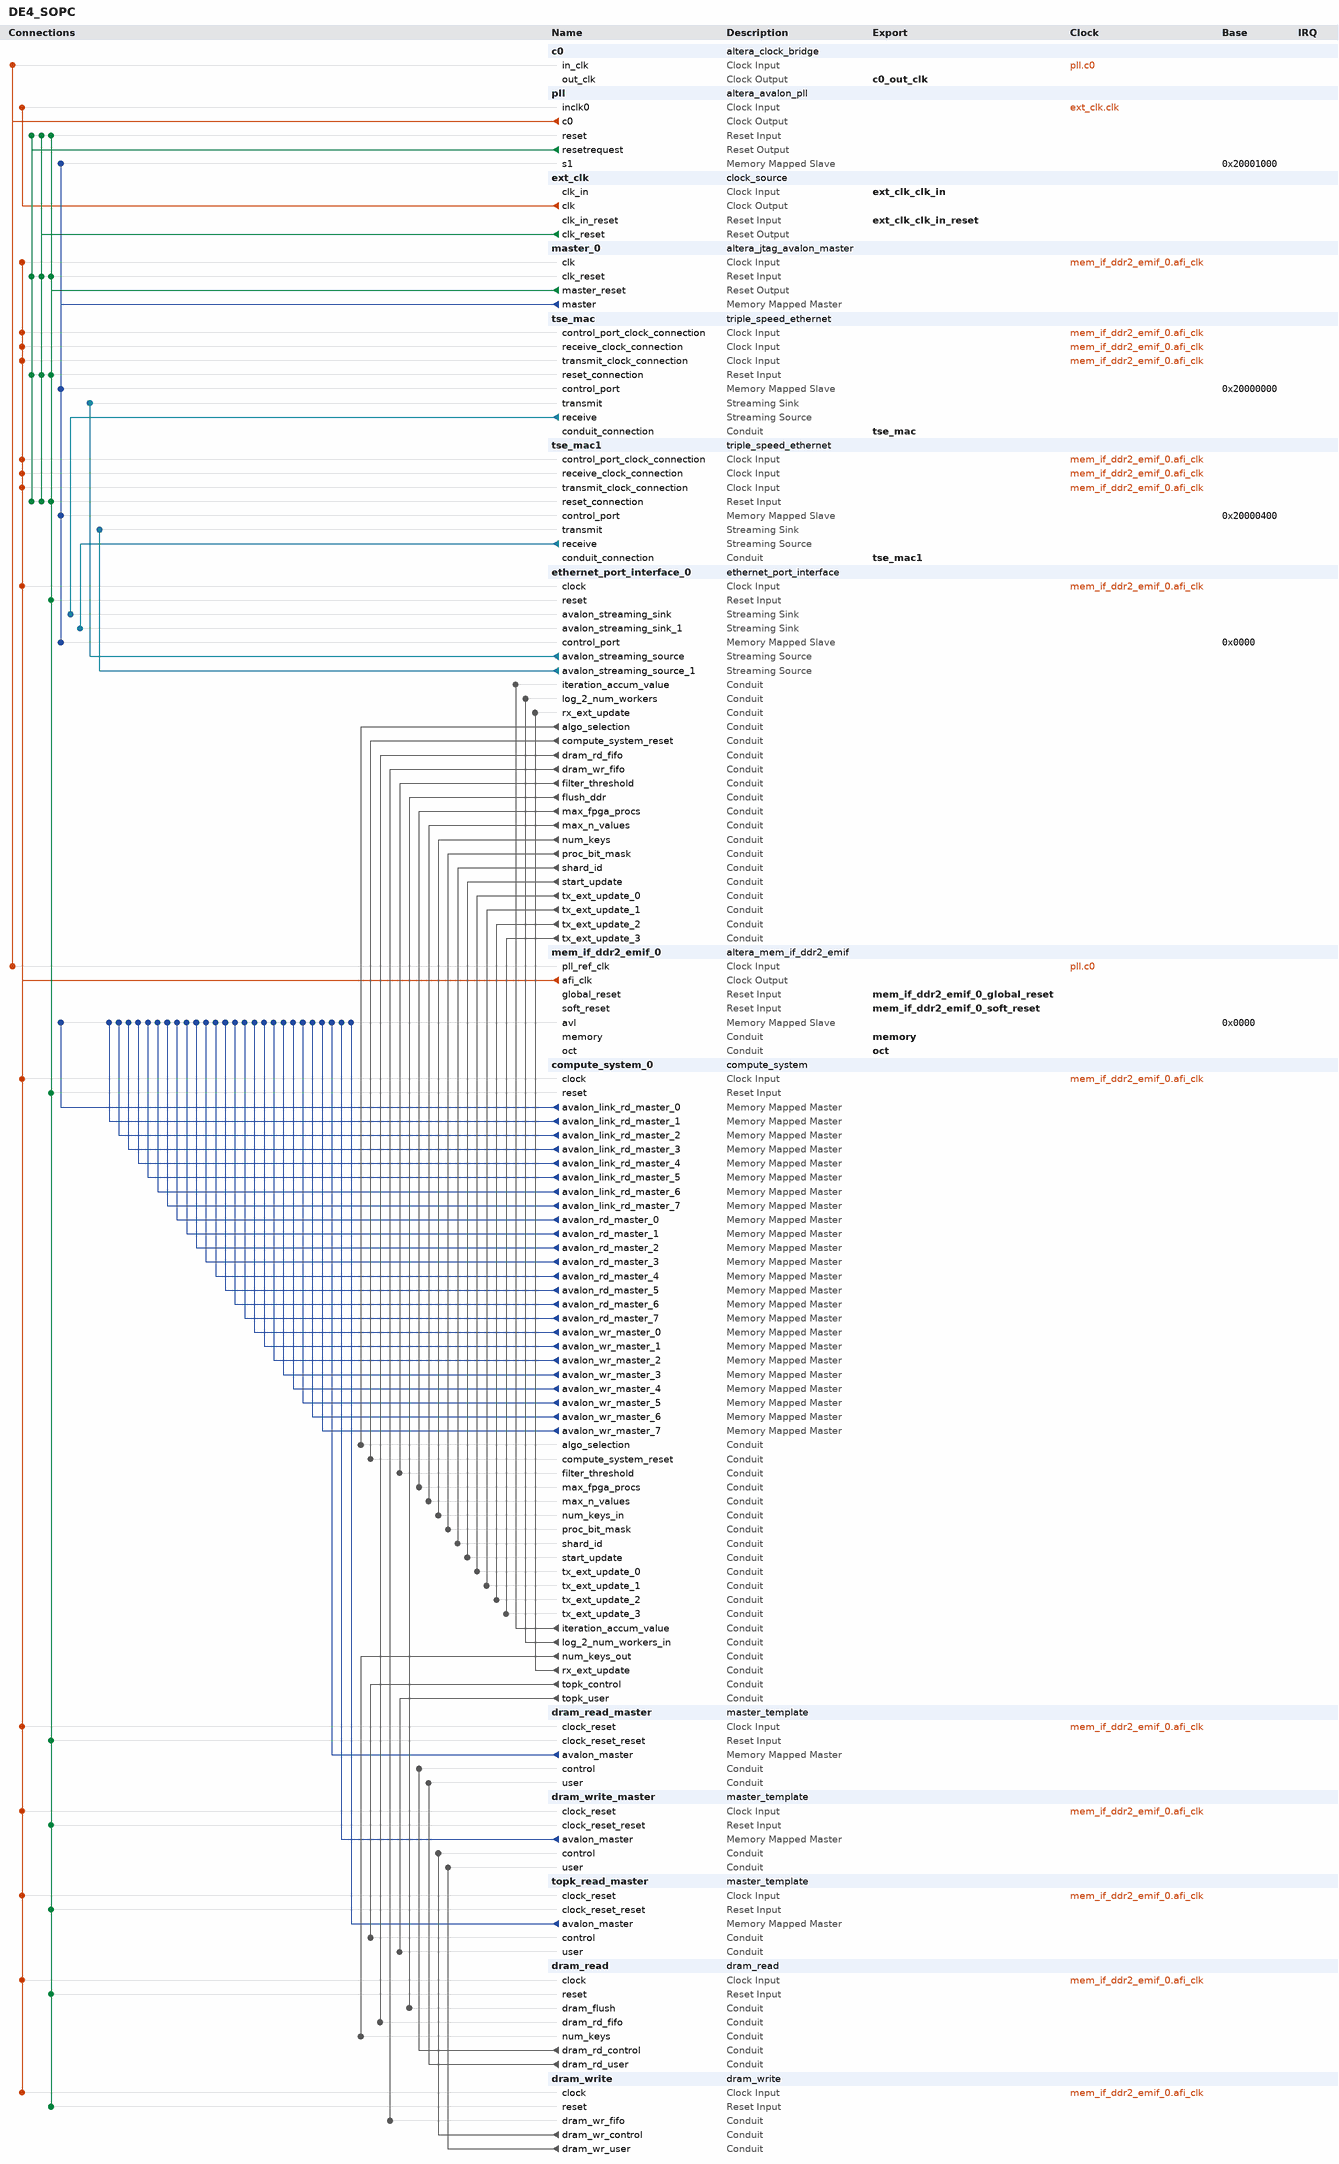
[diagram p0: system contents]
# Platform Designer (Qsys) system DE4_SOPC, Stratix IV EP4SGX230KF40C2
# Parameters at their usual value, and those the tool derives, are not listed.
package require -exact qsys 12.0
create_system DE4_SOPC
set_project_property DEVICE_FAMILY {Stratix IV}
set_project_property DEVICE EP4SGX230KF40C2

add_instance c0 altera_clock_bridge 12.0
set_instance_parameter_value c0 DERIVED_CLOCK_RATE 50000000
set_instance_parameter_value c0 EXPLICIT_CLOCK_RATE 0

add_instance pll altera_avalon_pll 12.0
set_instance_parameter_value pll c0 {tap c0 mult 1 div 1 phase 0 enabled true inputfreq 50000000 outputfreq 50000000}
set_instance_parameter_value pll c1 {tap c1 mult 1 div 5 phase 0 enabled true inputfreq 50000000 outputfreq 10000000}
set_instance_parameter_value pll c2 {tap c2 mult 1 div 1 phase 0 enabled false inputfreq 0 outputfreq 0}
set_instance_parameter_value pll c3 {tap c3 mult 1 div 1 phase 0 enabled false inputfreq 0 outputfreq 0}
set_instance_parameter_value pll c4 {tap c4 mult 1 div 1 phase 0 enabled false inputfreq 0 outputfreq 0}
set_instance_parameter_value pll c5 {tap c5 mult 1 div 1 phase 0 enabled false inputfreq 0 outputfreq 0}
set_instance_parameter_value pll c6 {tap c6 mult 1 div 1 phase 0 enabled false inputfreq 0 outputfreq 0}
set_instance_parameter_value pll c7 {tap c7 mult 1 div 1 phase 0 enabled false inputfreq 0 outputfreq 0}
set_instance_parameter_value pll c8 {tap c8 mult 1 div 1 phase 0 enabled false inputfreq 0 outputfreq 0}
set_instance_parameter_value pll c9 {tap c9 mult 1 div 1 phase 0 enabled false inputfreq 0 outputfreq 0}
set_instance_parameter_value pll e0 {tap e0 mult 1 div 1 phase 0 enabled false inputfreq 0 outputfreq 0}
set_instance_parameter_value pll e1 {tap e1 mult 1 div 1 phase 0 enabled false inputfreq 0 outputfreq 0}
set_instance_parameter_value pll e2 {tap e2 mult 1 div 1 phase 0 enabled false inputfreq 0 outputfreq 0}
set_instance_parameter_value pll e3 {tap e3 mult 1 div 1 phase 0 enabled false inputfreq 0 outputfreq 0}
set_instance_parameter_value pll inputClockRate 50000000
set_instance_parameter_value pll lockedOutputPortOption Export
set_instance_parameter_value pll pfdenaInputPortOption Register
set_instance_parameter_value pll resetInputPortOption Register

add_instance ext_clk clock_source 12.0
set_instance_parameter_value ext_clk clockFrequency 50000000

add_instance master_0 altera_jtag_avalon_master 12.0

add_instance tse_mac triple_speed_ethernet 12.0
set_instance_parameter_value tse_mac atlanticSinkClockRate 0
set_instance_parameter_value tse_mac atlanticSinkClockSource unassigned
set_instance_parameter_value tse_mac atlanticSourceClockRate 0
set_instance_parameter_value tse_mac atlanticSourceClockSource unassigned
set_instance_parameter_value tse_mac avalonSlaveClockRate 0
set_instance_parameter_value tse_mac avalonSlaveClockSource unassigned
set_instance_parameter_value tse_mac avalonStNeighbours {unassigned=unassigned}
set_instance_parameter_value tse_mac channel_count 1
set_instance_parameter_value tse_mac core_variation MAC_PCS
set_instance_parameter_value tse_mac core_version 3072
set_instance_parameter_value tse_mac crc32check16bit 0
set_instance_parameter_value tse_mac crc32dwidth 8
set_instance_parameter_value tse_mac crc32gendelay 6
set_instance_parameter_value tse_mac crc32s1l2_extern false
set_instance_parameter_value tse_mac cust_version 0
set_instance_parameter_value tse_mac dataBitsPerSymbol 8
set_instance_parameter_value tse_mac dev_version 3072
set_instance_parameter_value tse_mac eg_addr 11
set_instance_parameter_value tse_mac ena_hash true
set_instance_parameter_value tse_mac enable_alt_reconfig false
set_instance_parameter_value tse_mac enable_clk_sharing false
set_instance_parameter_value tse_mac enable_ena 8
set_instance_parameter_value tse_mac enable_fifoless false
set_instance_parameter_value tse_mac enable_gmii_loopback false
set_instance_parameter_value tse_mac enable_hd_logic true
set_instance_parameter_value tse_mac enable_mac_flow_ctrl true
set_instance_parameter_value tse_mac enable_mac_txaddr_set true
set_instance_parameter_value tse_mac enable_mac_vlan true
set_instance_parameter_value tse_mac enable_maclite false
set_instance_parameter_value tse_mac enable_magic_detect true
set_instance_parameter_value tse_mac enable_multi_channel false
set_instance_parameter_value tse_mac enable_pkt_class true
set_instance_parameter_value tse_mac enable_pma false
set_instance_parameter_value tse_mac enable_ptp_1step false
set_instance_parameter_value tse_mac enable_reg_sharing false
set_instance_parameter_value tse_mac enable_sgmii true
set_instance_parameter_value tse_mac enable_shift16 false
set_instance_parameter_value tse_mac enable_sup_addr true
set_instance_parameter_value tse_mac enable_timestamping false
set_instance_parameter_value tse_mac enable_use_internal_fifo true
set_instance_parameter_value tse_mac export_calblkclk false
set_instance_parameter_value tse_mac export_pwrdn false
set_instance_parameter_value tse_mac ext_stat_cnt_ena false
set_instance_parameter_value tse_mac gigeAdvanceMode true
set_instance_parameter_value tse_mac ifGMII MII_GMII
set_instance_parameter_value tse_mac ifPCSuseEmbeddedSerdes true
set_instance_parameter_value tse_mac ing_addr 11
set_instance_parameter_value tse_mac insert_ta true
set_instance_parameter_value tse_mac maclite_gige false
set_instance_parameter_value tse_mac max_channels 1
set_instance_parameter_value tse_mac mdio_clk_div 50
set_instance_parameter_value tse_mac phy_identifier 0
set_instance_parameter_value tse_mac ramType AUTO
set_instance_parameter_value tse_mac reset_level 1
set_instance_parameter_value tse_mac starting_channel_number 0
set_instance_parameter_value tse_mac stat_cnt_ena true
set_instance_parameter_value tse_mac timingAdapterName timingAdapter
set_instance_parameter_value tse_mac toolContext SOPC_BUILDER
set_instance_parameter_value tse_mac transceiver_type LVDS_IO
set_instance_parameter_value tse_mac tstamp_fp_width 4
set_instance_parameter_value tse_mac uiHostClockFrequency 0
set_instance_parameter_value tse_mac uiMDIOFreq {0.0 MHz}
set_instance_parameter_value tse_mac useLvds true
set_instance_parameter_value tse_mac useMAC true
set_instance_parameter_value tse_mac useMDIO true
set_instance_parameter_value tse_mac usePCS true
set_instance_parameter_value tse_mac use_sync_reset true

add_instance tse_mac1 triple_speed_ethernet 12.0
set_instance_parameter_value tse_mac1 atlanticSinkClockRate 0
set_instance_parameter_value tse_mac1 atlanticSinkClockSource unassigned
set_instance_parameter_value tse_mac1 atlanticSourceClockRate 0
set_instance_parameter_value tse_mac1 atlanticSourceClockSource unassigned
set_instance_parameter_value tse_mac1 avalonSlaveClockRate 0
set_instance_parameter_value tse_mac1 avalonSlaveClockSource unassigned
set_instance_parameter_value tse_mac1 avalonStNeighbours {unassigned=unassigned}
set_instance_parameter_value tse_mac1 channel_count 1
set_instance_parameter_value tse_mac1 core_variation MAC_PCS
set_instance_parameter_value tse_mac1 core_version 3072
set_instance_parameter_value tse_mac1 crc32check16bit 0
set_instance_parameter_value tse_mac1 crc32dwidth 8
set_instance_parameter_value tse_mac1 crc32gendelay 6
set_instance_parameter_value tse_mac1 crc32s1l2_extern false
set_instance_parameter_value tse_mac1 cust_version 0
set_instance_parameter_value tse_mac1 dataBitsPerSymbol 8
set_instance_parameter_value tse_mac1 dev_version 3072
set_instance_parameter_value tse_mac1 eg_addr 11
set_instance_parameter_value tse_mac1 ena_hash true
set_instance_parameter_value tse_mac1 enable_alt_reconfig false
set_instance_parameter_value tse_mac1 enable_clk_sharing false
set_instance_parameter_value tse_mac1 enable_ena 8
set_instance_parameter_value tse_mac1 enable_fifoless false
set_instance_parameter_value tse_mac1 enable_gmii_loopback false
set_instance_parameter_value tse_mac1 enable_hd_logic true
set_instance_parameter_value tse_mac1 enable_mac_flow_ctrl true
set_instance_parameter_value tse_mac1 enable_mac_txaddr_set true
set_instance_parameter_value tse_mac1 enable_mac_vlan true
set_instance_parameter_value tse_mac1 enable_maclite false
set_instance_parameter_value tse_mac1 enable_magic_detect true
set_instance_parameter_value tse_mac1 enable_multi_channel false
set_instance_parameter_value tse_mac1 enable_pkt_class true
set_instance_parameter_value tse_mac1 enable_pma false
set_instance_parameter_value tse_mac1 enable_ptp_1step false
set_instance_parameter_value tse_mac1 enable_reg_sharing false
set_instance_parameter_value tse_mac1 enable_sgmii true
set_instance_parameter_value tse_mac1 enable_shift16 false
set_instance_parameter_value tse_mac1 enable_sup_addr true
set_instance_parameter_value tse_mac1 enable_timestamping false
set_instance_parameter_value tse_mac1 enable_use_internal_fifo true
set_instance_parameter_value tse_mac1 export_calblkclk false
set_instance_parameter_value tse_mac1 export_pwrdn false
set_instance_parameter_value tse_mac1 ext_stat_cnt_ena false
set_instance_parameter_value tse_mac1 gigeAdvanceMode true
set_instance_parameter_value tse_mac1 ifGMII MII_GMII
set_instance_parameter_value tse_mac1 ifPCSuseEmbeddedSerdes true
set_instance_parameter_value tse_mac1 ing_addr 11
set_instance_parameter_value tse_mac1 insert_ta true
set_instance_parameter_value tse_mac1 maclite_gige false
set_instance_parameter_value tse_mac1 max_channels 1
set_instance_parameter_value tse_mac1 mdio_clk_div 50
set_instance_parameter_value tse_mac1 phy_identifier 0
set_instance_parameter_value tse_mac1 ramType AUTO
set_instance_parameter_value tse_mac1 reset_level 1
set_instance_parameter_value tse_mac1 starting_channel_number 0
set_instance_parameter_value tse_mac1 stat_cnt_ena true
set_instance_parameter_value tse_mac1 timingAdapterName timingAdapter
set_instance_parameter_value tse_mac1 toolContext SOPC_BUILDER
set_instance_parameter_value tse_mac1 transceiver_type LVDS_IO
set_instance_parameter_value tse_mac1 tstamp_fp_width 4
set_instance_parameter_value tse_mac1 uiHostClockFrequency 0
set_instance_parameter_value tse_mac1 uiMDIOFreq {0.0 MHz}
set_instance_parameter_value tse_mac1 useLvds true
set_instance_parameter_value tse_mac1 useMAC true
set_instance_parameter_value tse_mac1 useMDIO true
set_instance_parameter_value tse_mac1 usePCS true
set_instance_parameter_value tse_mac1 use_sync_reset true

add_instance ethernet_port_interface_0 ethernet_port_interface 1.0
set_instance_parameter_value ethernet_port_interface_0 WORKER_ADDR_WIDTH 2
set_instance_parameter_value ethernet_port_interface_0 TOTAL_DATA 8

add_instance mem_if_ddr2_emif_0 altera_mem_if_ddr2_emif 12.0
set_instance_parameter_value mem_if_ddr2_emif_0 MEM_CLK_FREQ 250.0
set_instance_parameter_value mem_if_ddr2_emif_0 MEM_VENDOR Hynix
set_instance_parameter_value mem_if_ddr2_emif_0 MEM_ROW_ADDR_WIDTH 14
set_instance_parameter_value mem_if_ddr2_emif_0 MEM_COL_ADDR_WIDTH 10
set_instance_parameter_value mem_if_ddr2_emif_0 MEM_DQ_WIDTH 64
set_instance_parameter_value mem_if_ddr2_emif_0 MEM_BANKADDR_WIDTH 3
set_instance_parameter_value mem_if_ddr2_emif_0 MEM_NUMBER_OF_RANKS_PER_DIMM 1
set_instance_parameter_value mem_if_ddr2_emif_0 MEM_TCL 4
set_instance_parameter_value mem_if_ddr2_emif_0 TIMING_TIS 250
set_instance_parameter_value mem_if_ddr2_emif_0 TIMING_TIH 375
set_instance_parameter_value mem_if_ddr2_emif_0 TIMING_TDS 100
set_instance_parameter_value mem_if_ddr2_emif_0 TIMING_TDH 225
set_instance_parameter_value mem_if_ddr2_emif_0 TIMING_TDQSQ 200
set_instance_parameter_value mem_if_ddr2_emif_0 TIMING_TQHS 400
set_instance_parameter_value mem_if_ddr2_emif_0 TIMING_TDQSCK 450
set_instance_parameter_value mem_if_ddr2_emif_0 MEM_TMRD_CK 2
set_instance_parameter_value mem_if_ddr2_emif_0 MEM_TRAS_NS 40.0
set_instance_parameter_value mem_if_ddr2_emif_0 MEM_TWTR 2
set_instance_parameter_value mem_if_ddr2_emif_0 POWER_OF_TWO_BUS false
set_instance_parameter_value mem_if_ddr2_emif_0 AVL_MAX_SIZE 4
set_instance_parameter_value mem_if_ddr2_emif_0 CTL_CSR_ENABLED true
set_instance_parameter_value mem_if_ddr2_emif_0 REF_CLK_FREQ 50.0
set_instance_parameter_value mem_if_ddr2_emif_0 DEFAULT_FAST_SIM_MODEL true
set_instance_parameter_value mem_if_ddr2_emif_0 PLL_SHARING_MODE Master
set_instance_parameter_value mem_if_ddr2_emif_0 CALIBRATION_MODE Skip
set_instance_parameter_value mem_if_ddr2_emif_0 USER_DEBUG_LEVEL 1
set_instance_parameter_value mem_if_ddr2_emif_0 DLL_SHARING_MODE Master

add_instance compute_system_0 compute_system 1.0
set_instance_parameter_value compute_system_0 DATA_WIDTH 32
set_instance_parameter_value compute_system_0 MAX_NUM_PROCS 4
set_instance_parameter_value compute_system_0 WORKER_ADDR_WIDTH 2
set_instance_parameter_value compute_system_0 WORKER_FIFO_DEPTH 256
set_instance_parameter_value compute_system_0 ADDRESS_WIDTH 31
set_instance_parameter_value compute_system_0 DDR_BASE 0
set_instance_parameter_value compute_system_0 DDR_SIZE 1073741824
set_instance_parameter_value compute_system_0 MAX_K_VALUES 4
set_instance_parameter_value compute_system_0 MAX_N_VALUES 32
set_instance_parameter_value compute_system_0 TOTAL_KEYS 8

add_instance dram_read_master master_template 1.0
set_instance_parameter_value dram_read_master MASTER_DIRECTION 0
set_instance_parameter_value dram_read_master DATA_WIDTH 256
set_instance_parameter_value dram_read_master ADDRESS_WIDTH 31
set_instance_parameter_value dram_read_master BURST_CAPABLE 1
set_instance_parameter_value dram_read_master MAXIMUM_BURST_COUNT 2
set_instance_parameter_value dram_read_master FIFO_DEPTH 4
set_instance_parameter_value dram_read_master MEMORY_BASED_FIFO 1

add_instance dram_write_master master_template 1.0
set_instance_parameter_value dram_write_master MASTER_DIRECTION 1
set_instance_parameter_value dram_write_master DATA_WIDTH 256
set_instance_parameter_value dram_write_master ADDRESS_WIDTH 31
set_instance_parameter_value dram_write_master BURST_CAPABLE 1
set_instance_parameter_value dram_write_master MAXIMUM_BURST_COUNT 2
set_instance_parameter_value dram_write_master FIFO_DEPTH 4
set_instance_parameter_value dram_write_master MEMORY_BASED_FIFO 1

add_instance topk_read_master master_template 1.0
set_instance_parameter_value topk_read_master MASTER_DIRECTION 0
set_instance_parameter_value topk_read_master DATA_WIDTH 256
set_instance_parameter_value topk_read_master ADDRESS_WIDTH 31
set_instance_parameter_value topk_read_master BURST_CAPABLE 1
set_instance_parameter_value topk_read_master MAXIMUM_BURST_COUNT 8
set_instance_parameter_value topk_read_master FIFO_DEPTH 32
set_instance_parameter_value topk_read_master MEMORY_BASED_FIFO 1

add_instance dram_read dram_read 1.0
set_instance_parameter_value dram_read DDR_BASE 0
set_instance_parameter_value dram_read ADDRESS_WIDTH 32
set_instance_parameter_value dram_read TOTAL_DATA 8

add_instance dram_write dram_write 1.0
set_instance_parameter_value dram_write DDR_BASE 0
set_instance_parameter_value dram_write ADDRESS_WIDTH 32

# connections
add_connection ext_clk.clk pll.inclk0 clock
add_connection mem_if_ddr2_emif_0.afi_clk compute_system_0.clock clock
add_connection mem_if_ddr2_emif_0.afi_clk dram_read.clock clock
add_connection mem_if_ddr2_emif_0.afi_clk dram_read_master.clock_reset clock
add_connection mem_if_ddr2_emif_0.afi_clk dram_write.clock clock
add_connection mem_if_ddr2_emif_0.afi_clk dram_write_master.clock_reset clock
add_connection mem_if_ddr2_emif_0.afi_clk ethernet_port_interface_0.clock clock
add_connection mem_if_ddr2_emif_0.afi_clk master_0.clk clock
add_connection mem_if_ddr2_emif_0.afi_clk topk_read_master.clock_reset clock
add_connection mem_if_ddr2_emif_0.afi_clk tse_mac1.control_port_clock_connection clock
add_connection mem_if_ddr2_emif_0.afi_clk tse_mac1.receive_clock_connection clock
add_connection mem_if_ddr2_emif_0.afi_clk tse_mac1.transmit_clock_connection clock
add_connection mem_if_ddr2_emif_0.afi_clk tse_mac.control_port_clock_connection clock
add_connection mem_if_ddr2_emif_0.afi_clk tse_mac.receive_clock_connection clock
add_connection mem_if_ddr2_emif_0.afi_clk tse_mac.transmit_clock_connection clock
add_connection pll.c0 c0.in_clk clock
add_connection pll.c0 mem_if_ddr2_emif_0.pll_ref_clk clock
add_connection ext_clk.clk_reset master_0.clk_reset reset
add_connection ext_clk.clk_reset pll.reset reset
add_connection ext_clk.clk_reset tse_mac1.reset_connection reset
add_connection ext_clk.clk_reset tse_mac.reset_connection reset
add_connection master_0.master_reset compute_system_0.reset reset
add_connection master_0.master_reset dram_read.reset reset
add_connection master_0.master_reset dram_read_master.clock_reset_reset reset
add_connection master_0.master_reset dram_write.reset reset
add_connection master_0.master_reset dram_write_master.clock_reset_reset reset
add_connection master_0.master_reset ethernet_port_interface_0.reset reset
add_connection master_0.master_reset master_0.clk_reset reset
add_connection master_0.master_reset pll.reset reset
add_connection master_0.master_reset topk_read_master.clock_reset_reset reset
add_connection master_0.master_reset tse_mac1.reset_connection reset
add_connection master_0.master_reset tse_mac.reset_connection reset
add_connection pll.resetrequest master_0.clk_reset reset
add_connection pll.resetrequest pll.reset reset
add_connection pll.resetrequest tse_mac1.reset_connection reset
add_connection pll.resetrequest tse_mac.reset_connection reset
add_connection compute_system_0.avalon_link_rd_master_0 mem_if_ddr2_emif_0.avl avalon
set_connection_parameter_value compute_system_0.avalon_link_rd_master_0/mem_if_ddr2_emif_0.avl baseAddress 0x0000
add_connection compute_system_0.avalon_link_rd_master_1 mem_if_ddr2_emif_0.avl avalon
set_connection_parameter_value compute_system_0.avalon_link_rd_master_1/mem_if_ddr2_emif_0.avl baseAddress 0x0000
add_connection compute_system_0.avalon_link_rd_master_2 mem_if_ddr2_emif_0.avl avalon
set_connection_parameter_value compute_system_0.avalon_link_rd_master_2/mem_if_ddr2_emif_0.avl baseAddress 0x0000
add_connection compute_system_0.avalon_link_rd_master_3 mem_if_ddr2_emif_0.avl avalon
set_connection_parameter_value compute_system_0.avalon_link_rd_master_3/mem_if_ddr2_emif_0.avl baseAddress 0x0000
add_connection compute_system_0.avalon_link_rd_master_4 mem_if_ddr2_emif_0.avl avalon
set_connection_parameter_value compute_system_0.avalon_link_rd_master_4/mem_if_ddr2_emif_0.avl baseAddress 0x0000
add_connection compute_system_0.avalon_link_rd_master_5 mem_if_ddr2_emif_0.avl avalon
set_connection_parameter_value compute_system_0.avalon_link_rd_master_5/mem_if_ddr2_emif_0.avl baseAddress 0x0000
add_connection compute_system_0.avalon_link_rd_master_6 mem_if_ddr2_emif_0.avl avalon
set_connection_parameter_value compute_system_0.avalon_link_rd_master_6/mem_if_ddr2_emif_0.avl baseAddress 0x0000
add_connection compute_system_0.avalon_link_rd_master_7 mem_if_ddr2_emif_0.avl avalon
set_connection_parameter_value compute_system_0.avalon_link_rd_master_7/mem_if_ddr2_emif_0.avl baseAddress 0x0000
add_connection compute_system_0.avalon_rd_master_0 mem_if_ddr2_emif_0.avl avalon
set_connection_parameter_value compute_system_0.avalon_rd_master_0/mem_if_ddr2_emif_0.avl baseAddress 0x0000
add_connection compute_system_0.avalon_rd_master_1 mem_if_ddr2_emif_0.avl avalon
set_connection_parameter_value compute_system_0.avalon_rd_master_1/mem_if_ddr2_emif_0.avl baseAddress 0x0000
add_connection compute_system_0.avalon_rd_master_2 mem_if_ddr2_emif_0.avl avalon
set_connection_parameter_value compute_system_0.avalon_rd_master_2/mem_if_ddr2_emif_0.avl baseAddress 0x0000
add_connection compute_system_0.avalon_rd_master_3 mem_if_ddr2_emif_0.avl avalon
set_connection_parameter_value compute_system_0.avalon_rd_master_3/mem_if_ddr2_emif_0.avl baseAddress 0x0000
add_connection compute_system_0.avalon_rd_master_4 mem_if_ddr2_emif_0.avl avalon
set_connection_parameter_value compute_system_0.avalon_rd_master_4/mem_if_ddr2_emif_0.avl baseAddress 0x0000
add_connection compute_system_0.avalon_rd_master_5 mem_if_ddr2_emif_0.avl avalon
set_connection_parameter_value compute_system_0.avalon_rd_master_5/mem_if_ddr2_emif_0.avl baseAddress 0x0000
add_connection compute_system_0.avalon_rd_master_6 mem_if_ddr2_emif_0.avl avalon
set_connection_parameter_value compute_system_0.avalon_rd_master_6/mem_if_ddr2_emif_0.avl baseAddress 0x0000
add_connection compute_system_0.avalon_rd_master_7 mem_if_ddr2_emif_0.avl avalon
set_connection_parameter_value compute_system_0.avalon_rd_master_7/mem_if_ddr2_emif_0.avl baseAddress 0x0000
add_connection compute_system_0.avalon_wr_master_0 mem_if_ddr2_emif_0.avl avalon
set_connection_parameter_value compute_system_0.avalon_wr_master_0/mem_if_ddr2_emif_0.avl baseAddress 0x0000
add_connection compute_system_0.avalon_wr_master_1 mem_if_ddr2_emif_0.avl avalon
set_connection_parameter_value compute_system_0.avalon_wr_master_1/mem_if_ddr2_emif_0.avl baseAddress 0x0000
add_connection compute_system_0.avalon_wr_master_2 mem_if_ddr2_emif_0.avl avalon
set_connection_parameter_value compute_system_0.avalon_wr_master_2/mem_if_ddr2_emif_0.avl baseAddress 0x0000
add_connection compute_system_0.avalon_wr_master_3 mem_if_ddr2_emif_0.avl avalon
set_connection_parameter_value compute_system_0.avalon_wr_master_3/mem_if_ddr2_emif_0.avl baseAddress 0x0000
add_connection compute_system_0.avalon_wr_master_4 mem_if_ddr2_emif_0.avl avalon
set_connection_parameter_value compute_system_0.avalon_wr_master_4/mem_if_ddr2_emif_0.avl baseAddress 0x0000
add_connection compute_system_0.avalon_wr_master_5 mem_if_ddr2_emif_0.avl avalon
set_connection_parameter_value compute_system_0.avalon_wr_master_5/mem_if_ddr2_emif_0.avl baseAddress 0x0000
add_connection compute_system_0.avalon_wr_master_6 mem_if_ddr2_emif_0.avl avalon
set_connection_parameter_value compute_system_0.avalon_wr_master_6/mem_if_ddr2_emif_0.avl baseAddress 0x0000
add_connection compute_system_0.avalon_wr_master_7 mem_if_ddr2_emif_0.avl avalon
set_connection_parameter_value compute_system_0.avalon_wr_master_7/mem_if_ddr2_emif_0.avl baseAddress 0x0000
add_connection dram_read_master.avalon_master mem_if_ddr2_emif_0.avl avalon
set_connection_parameter_value dram_read_master.avalon_master/mem_if_ddr2_emif_0.avl baseAddress 0x0000
add_connection dram_write_master.avalon_master mem_if_ddr2_emif_0.avl avalon
set_connection_parameter_value dram_write_master.avalon_master/mem_if_ddr2_emif_0.avl baseAddress 0x0000
add_connection master_0.master ethernet_port_interface_0.control_port avalon
set_connection_parameter_value master_0.master/ethernet_port_interface_0.control_port baseAddress 0x0000
add_connection master_0.master pll.s1 avalon
set_connection_parameter_value master_0.master/pll.s1 baseAddress 0x20001000
add_connection master_0.master tse_mac1.control_port avalon
set_connection_parameter_value master_0.master/tse_mac1.control_port baseAddress 0x20000400
add_connection master_0.master tse_mac.control_port avalon
set_connection_parameter_value master_0.master/tse_mac.control_port baseAddress 0x20000000
add_connection topk_read_master.avalon_master mem_if_ddr2_emif_0.avl avalon
set_connection_parameter_value topk_read_master.avalon_master/mem_if_ddr2_emif_0.avl baseAddress 0x0000
add_connection ethernet_port_interface_0.avalon_streaming_source tse_mac.transmit avalon_streaming
add_connection ethernet_port_interface_0.avalon_streaming_source_1 tse_mac1.transmit avalon_streaming
add_connection tse_mac1.receive ethernet_port_interface_0.avalon_streaming_sink_1 avalon_streaming
add_connection tse_mac.receive ethernet_port_interface_0.avalon_streaming_sink avalon_streaming
add_connection compute_system_0.iteration_accum_value ethernet_port_interface_0.iteration_accum_value conduit
add_connection compute_system_0.log_2_num_workers_in ethernet_port_interface_0.log_2_num_workers conduit
add_connection compute_system_0.num_keys_out dram_read.num_keys conduit
add_connection compute_system_0.rx_ext_update ethernet_port_interface_0.rx_ext_update conduit
add_connection compute_system_0.topk_control topk_read_master.control conduit
add_connection compute_system_0.topk_user topk_read_master.user conduit
add_connection dram_read.dram_rd_control dram_read_master.control conduit
add_connection dram_read.dram_rd_user dram_read_master.user conduit
add_connection dram_write.dram_wr_control dram_write_master.control conduit
add_connection dram_write.dram_wr_user dram_write_master.user conduit
add_connection ethernet_port_interface_0.algo_selection compute_system_0.algo_selection conduit
add_connection ethernet_port_interface_0.compute_system_reset compute_system_0.compute_system_reset conduit
add_connection ethernet_port_interface_0.dram_rd_fifo dram_read.dram_rd_fifo conduit
add_connection ethernet_port_interface_0.dram_wr_fifo dram_write.dram_wr_fifo conduit
add_connection ethernet_port_interface_0.filter_threshold compute_system_0.filter_threshold conduit
add_connection ethernet_port_interface_0.flush_ddr dram_read.dram_flush conduit
add_connection ethernet_port_interface_0.max_fpga_procs compute_system_0.max_fpga_procs conduit
add_connection ethernet_port_interface_0.max_n_values compute_system_0.max_n_values conduit
add_connection ethernet_port_interface_0.num_keys compute_system_0.num_keys_in conduit
add_connection ethernet_port_interface_0.proc_bit_mask compute_system_0.proc_bit_mask conduit
add_connection ethernet_port_interface_0.shard_id compute_system_0.shard_id conduit
add_connection ethernet_port_interface_0.start_update compute_system_0.start_update conduit
add_connection ethernet_port_interface_0.tx_ext_update_0 compute_system_0.tx_ext_update_0 conduit
add_connection ethernet_port_interface_0.tx_ext_update_1 compute_system_0.tx_ext_update_1 conduit
add_connection ethernet_port_interface_0.tx_ext_update_2 compute_system_0.tx_ext_update_2 conduit
add_connection ethernet_port_interface_0.tx_ext_update_3 compute_system_0.tx_ext_update_3 conduit

# exported interfaces
add_interface c0_out_clk clock source
set_interface_property c0_out_clk EXPORT_OF c0.out_clk
add_interface tse_mac1 conduit end
set_interface_property tse_mac1 EXPORT_OF tse_mac1.conduit_connection
add_interface ext_clk_clk_in clock sink
set_interface_property ext_clk_clk_in EXPORT_OF ext_clk.clk_in
add_interface tse_mac conduit end
set_interface_property tse_mac EXPORT_OF tse_mac.conduit_connection
add_interface memory conduit end
set_interface_property memory EXPORT_OF mem_if_ddr2_emif_0.memory
add_interface oct conduit end
set_interface_property oct EXPORT_OF mem_if_ddr2_emif_0.oct
add_interface mem_if_ddr2_emif_0_global_reset reset sink
set_interface_property mem_if_ddr2_emif_0_global_reset EXPORT_OF mem_if_ddr2_emif_0.global_reset
add_interface mem_if_ddr2_emif_0_soft_reset reset sink
set_interface_property mem_if_ddr2_emif_0_soft_reset EXPORT_OF mem_if_ddr2_emif_0.soft_reset
add_interface ext_clk_clk_in_reset reset sink
set_interface_property ext_clk_clk_in_reset EXPORT_OF ext_clk.clk_in_reset

save_system DE4_SOPC.qsys
